# Altium schematic sheet Control Unit and Power.SchDoc: CONTROL UNIT AND POWER MANAGEMENT
size A2; DrawnBy: Avishka Herath; DocumentNumber: 2; Revision: 1.6; SheetNumber: 2; SheetTotal: 2; Project: Coco V2.0 PCB
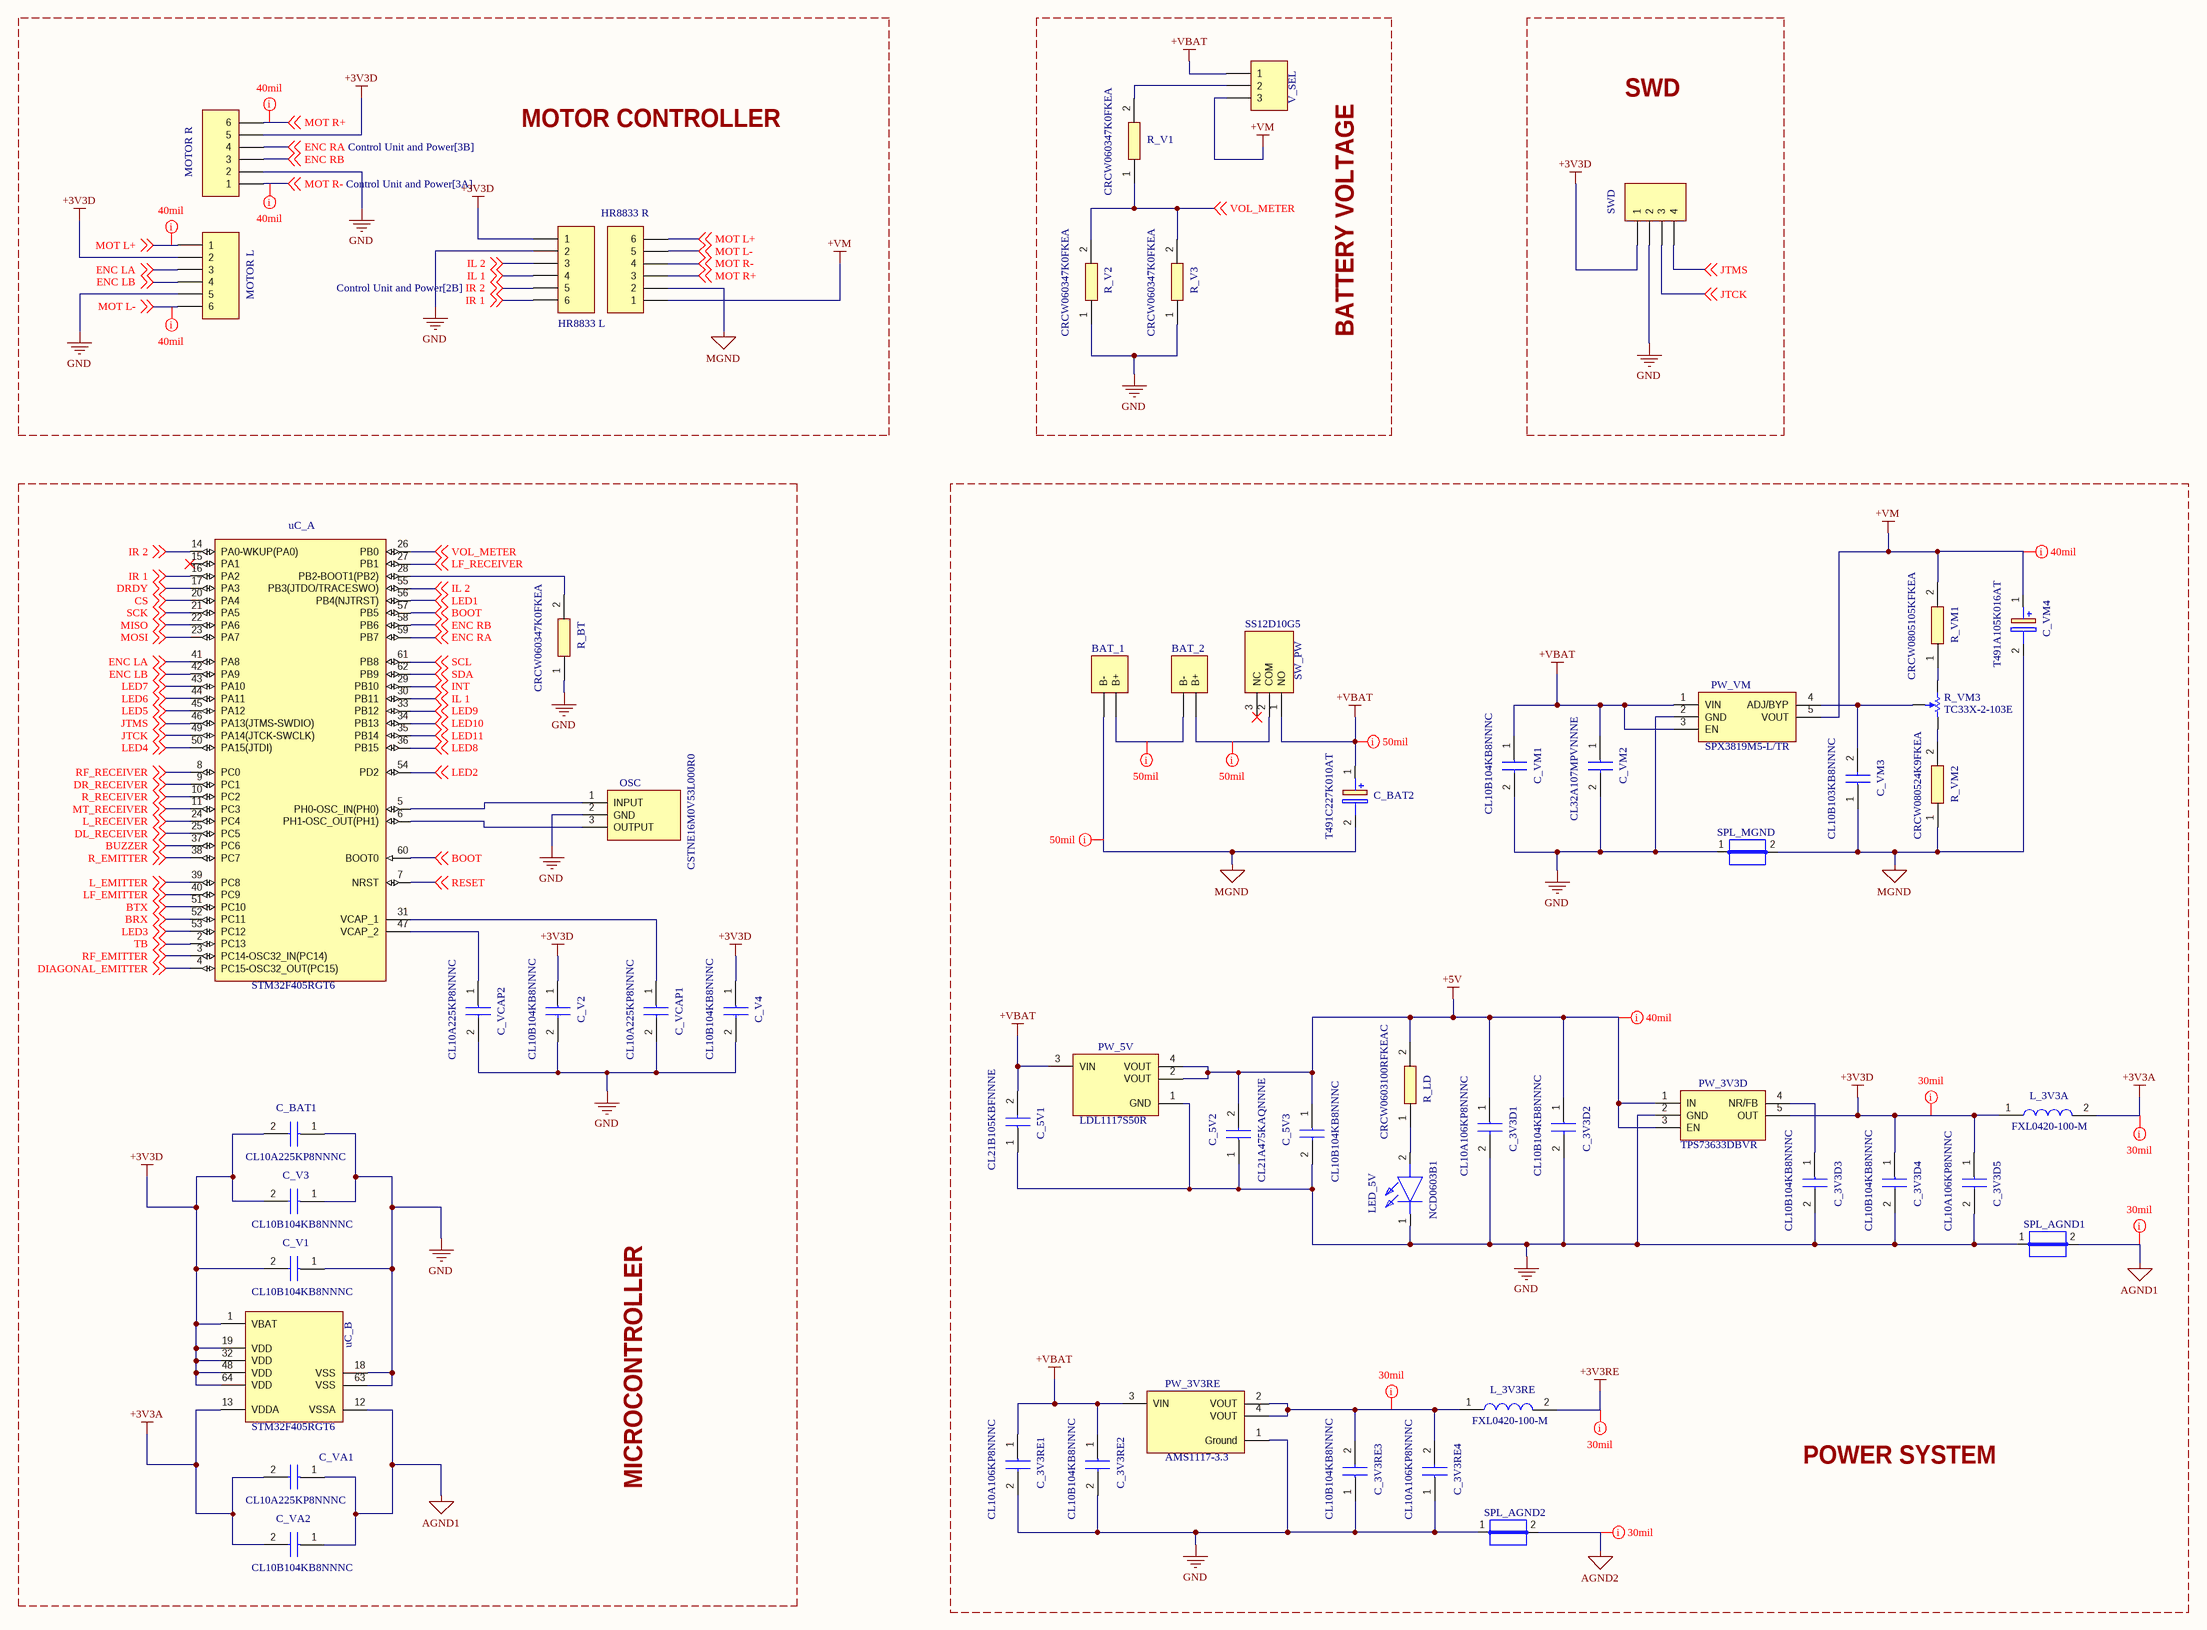
[diagram p0: Control Unit and Power.SchDoc]

## Parts
BAT_1  Header 2  [MY_6410-02]  (value not drawn)
BAT_2  Header 2  [MY_6410-02]  (value not drawn)
C_3V3D1  CL10A106KP8NNNC  [CAPC1608X90N]
C_3V3D2  CL10B104KB8NNNC  [CAPC1608X90N]
C_3V3D3  CL10B104KB8NNNC  [CAPC1608X90N]
C_3V3D4  CL10B104KB8NNNC  [CAPC1608X90N]
C_3V3D5  CL10A106KP8NNNC  [CAPC1608X90N]
C_3V3RE1  CL10A106KP8NNNC  [CAPC1608X90N]
C_3V3RE2  CL10B104KB8NNNC  [CAPC1608X90N]
C_3V3RE3  CL10B104KB8NNNC  [CAPC1608X90N]
C_3V3RE4  CL10A106KP8NNNC  [CAPC1608X90N]
C_5V1  CL21B105KBFNNNE  [CAPC2012X135N]
C_5V2  CL21A475KAQNNNE  [CAPC2012X140N]
C_5V3  CL10B104KB8NNNC  [CAPC1608X90N]
C_BAT1  CL10A225KP8NNNC  [CAPC1608X90N]
C_BAT2  T491C227K010AT  [T491C]
C_V1  CL10B104KB8NNNC  [CAPC1608X90N]
C_V2  CL10B104KB8NNNC  [CAPC1608X90N]
C_V3  CL10B104KB8NNNC  [CAPC1608X90N]
C_V4  CL10B104KB8NNNC  [CAPC1608X90N]
C_VA1  CL10A225KP8NNNC  [CAPC1608X90N]
C_VA2  CL10B104KB8NNNC  [CAPC1608X90N]
C_VCAP1  CL10A225KP8NNNC  [CAPC1608X90N]
C_VCAP2  CL10A225KP8NNNC  [CAPC1608X90N]
C_VM1  CL10B104KB8NNNC  [CAPC1608X90N]
C_VM2  CL32A107MPVNNNE  [CAPC3225X280N]
C_VM3  CL10B103KB8NNNC  [CAPC1608X90N]
C_VM4  T491A105K016AT  [T491A]
HR8833_L  Header 6  [My_1X06]  (value not drawn)
HR8833_R  Header 6  [My_1X06]  (value not drawn)
L_3V3A  FXL0420-100-M  [INDPM4441X120N]
L_3V3RE  FXL0420-100-M  [INDPM4441X120N]
LED_5V  NCD0603B1  [LEDC1608X40N]
MOTOR_L  Header 6  [MY_53253-0670]  (value not drawn)
MOTOR_R  Header 6  [MY_53253-0670]  (value not drawn)
OSC  CSTNE16M0V53L000R0  [CSTNE16M0V53L000R0]
PW_3V3D  TPS73633DBVR  [SOT95P280X145-5N]
PW_3V3RE  AMS1117-3.3  [FP-AMS1117-IPC_C]
PW_5V  LDL1117S50R  [FP-SOT-223-0046067_14-MFG]
PW_VM  SPX3819M5-L/TR  [SOT95P280X145-5N]
R_BT  CRCW060347K0FKEA  [RESC1608X50N]
R_LD  CRCW0603100RFKEAC  [RESC1608X55N]
R_V1  CRCW060347K0FKEA  [RESC1608X50N]
R_V2  CRCW060347K0FKEA  [RESC1608X50N]
R_V3  CRCW060347K0FKEA  [RESC1608X50N]
R_VM1  CRCW0805105KFKEA  [RESC2012X50N]
R_VM2  CRCW080524K9FKEA  [RESC2012X50N]
R_VM3  TC33X-2-103E  [BOUR-TC33X-2_V]
SPL_AGND1  JUMPER  [JUMPER]  (value not drawn)
SPL_AGND2  JUMPER  [JUMPER]  (value not drawn)
SPL_MGND  JUMPER  [JUMPER]  (value not drawn)
SW_PW  SS12D10G5  [GH36P010001]
SWD  Header 4  [MY_FE04]  (value not drawn)
uC_  STM32F405RGT6  [STM-LQFP64_V]  (parts A,B of 2)
V_SEL  Header 3  [My_1X03]  (value not drawn)

## Blocks framed on the sheet
MOTOR CONTROLLER: HR8833_L HR8833_R MOTOR_L MOTOR_R
BATTERY VOLTAGE: R_V1-R_V3 V_SEL
SWD: SWD
MICROCONTROLLER: C_BAT1 C_V1-C_V4 C_VA1 C_VA2 C_VCAP1 C_VCAP2 OSC R_BT uC_
POWER SYSTEM: BAT_1 BAT_2 C_3V3D1-C_3V3D5 C_3V3RE1-C_3V3RE4 C_5V1-C_5V3 C_BAT2 C_VM1-C_VM4 L_3V3A L_3V3RE LED_5V PW_3V3D PW_3V3RE PW_5V PW_VM R_LD R_VM1-R_VM3 SPL_AGND1 SPL_AGND2 SPL_MGND SW_PW

## Nets
+3V3A: C_VA1.2 C_VA2.2 L_3V3A.2 uC_.13(VDDA)
+3V3D: C_3V3D4.1 C_3V3D5.1 C_BAT1.2 C_V1.2 C_V2.1 C_V3.2 C_V4.1 HR8833_L.1 L_3V3A.1 MOTOR_L.2 MOTOR_R.5 PW_3V3D.5(OUT) SWD.1 uC_.1(VBAT) uC_.19(VDD) uC_.32(VDD) uC_.48(VDD) uC_.64(VDD)
+3V3RE: L_3V3RE.2
+5V: C_3V3D1.1 C_3V3D2.1 C_5V2.2 C_5V3.1 PW_3V3D.1(IN) PW_3V3D.3(EN) PW_5V.2(VOUT) PW_5V.4(VOUT) R_LD.2
+VBAT: C_3V3RE1.1 C_3V3RE2.1 C_5V1.2 C_BAT2.1(+) C_VM1.1 C_VM2.1 PW_3V3RE.3(VIN) PW_5V.3(VIN) PW_VM.1(VIN) PW_VM.3(EN) SW_PW.1(NO) V_SEL.1
+VM: C_VM4.1(+) HR8833_R.1 PW_VM.5(VOUT) R_VM1.2 V_SEL.3
AGND1: C_VA1.1 C_VA2.1 SPL_AGND1.2 uC_.12(VSSA)
AGND2: SPL_AGND2.2
GND: C_3V3D1.2 C_3V3D2.2 C_3V3D3.2 C_3V3D4.2 C_3V3D5.2 C_3V3RE1.2 C_3V3RE2.2 C_3V3RE3.1 C_3V3RE4.1 C_5V1.1 C_5V2.1 C_5V3.2 C_BAT1.1 C_V1.1 C_V2.2 C_V3.1 C_V4.2 C_VCAP1.2 C_VCAP2.2 C_VM1.2 C_VM2.2 HR8833_L.2 LED_5V.1(K) MOTOR_L.5 MOTOR_R.2 OSC.2(GND) PW_3V3D.2(GND) PW_3V3RE.1(Ground) PW_5V.1(GND) PW_VM.2(GND) R_BT.1 R_V2.1 R_V3.1 SPL_AGND1.1 SPL_AGND2.1 SPL_MGND.1 SWD.2 uC_.18(VSS) uC_.63(VSS)
MGND: BAT_1.2(B-) C_BAT2.2(-) C_VM3.1 C_VM4.2(-) HR8833_R.2 R_VM2.1 SPL_MGND.2
BOOT: uC_.57(PB5) uC_.60(BOOT0) ; off-sheet BOOT
BRX: uC_.52(PC11) ; off-sheet BRX
BTX: uC_.51(PC10) ; off-sheet BTX
BUZZER: uC_.37(PC6) ; off-sheet BUZZER
CS: uC_.20(PA4) ; off-sheet CS
DIAGONAL_EMITTER: uC_.4(PC15-OSC32_OUT(PC15)) ; off-sheet DIAGONAL_EMITTER
DL_RECEIVER: uC_.25(PC5) ; off-sheet DL_RECEIVER
DR_RECEIVER: uC_.9(PC1) ; off-sheet DR_RECEIVER
DRDY: uC_.17(PA3) ; off-sheet DRDY
ENC LA: MOTOR_L.3 uC_.41(PA8) ; off-sheet ENC LA
ENC LB: MOTOR_L.4 uC_.42(PA9) ; off-sheet ENC LB
ENC RA: MOTOR_R.4 uC_.59(PB7) ; off-sheet ENC RA
ENC RB: MOTOR_R.3 uC_.58(PB6) ; off-sheet ENC RB
IL 1: HR8833_L.4 uC_.30(PB11) ; off-sheet IL 1
IL 2: HR8833_L.3 uC_.55(PB3(JTDO/TRACESWO)) ; off-sheet IL 2
INT: uC_.29(PB10) ; off-sheet INT
IR 1: HR8833_L.6 uC_.16(PA2) ; off-sheet IR 1
IR 2: HR8833_L.5 uC_.14(PA0-WKUP(PA0)) ; off-sheet IR 2
JTCK: SWD.3 uC_.49(PA14(JTCK-SWCLK)) ; off-sheet JTCK
JTMS: SWD.4 uC_.46(PA13(JTMS-SWDIO)) ; off-sheet JTMS
L_EMITTER: uC_.39(PC8) ; off-sheet L_EMITTER
L_RECEIVER: uC_.24(PC4) ; off-sheet L_RECEIVER
LED1: uC_.56(PB4(NJTRST)) ; off-sheet LED1
LED2: uC_.54(PD2) ; off-sheet LED2
LED3: uC_.53(PC12) ; off-sheet LED3
LED4: uC_.50(PA15(JTDI)) ; off-sheet LED4
LED5: uC_.45(PA12) ; off-sheet LED5
LED6: uC_.44(PA11) ; off-sheet LED6
LED7: uC_.43(PA10) ; off-sheet LED7
LED8: uC_.36(PB15) ; off-sheet LED8
LED9: uC_.33(PB12) ; off-sheet LED9
LED10: uC_.34(PB13) ; off-sheet LED10
LED11: uC_.35(PB14) ; off-sheet LED11
LF_EMITTER: uC_.40(PC9) ; off-sheet LF_EMITTER
LF_RECEIVER: uC_.27(PB1) ; off-sheet LF_RECEIVER
MISO: uC_.22(PA6) ; off-sheet MISO
MOSI: uC_.23(PA7) ; off-sheet MOSI
MOT L+: HR8833_R.6 MOTOR_L.1 ; off-sheet MOT L+
MOT L-: HR8833_R.5 MOTOR_L.6 ; off-sheet MOT L-
MOT R+: HR8833_R.3 MOTOR_R.6 ; off-sheet MOT R+
MOT R-: HR8833_R.4 MOTOR_R.1 ; off-sheet MOT R-
MT_RECEIVER: uC_.11(PC3) ; off-sheet MT_RECEIVER
R_EMITTER: uC_.38(PC7) ; off-sheet R_EMITTER
R_RECEIVER: uC_.10(PC2) ; off-sheet R_RECEIVER
RESET: uC_.7(NRST) ; off-sheet RESET
RF_EMITTER: uC_.3(PC14-OSC32_IN(PC14)) ; off-sheet RF_EMITTER
RF_RECEIVER: uC_.8(PC0) ; off-sheet RF_RECEIVER
SCK: uC_.21(PA5) ; off-sheet SCK
SCL: uC_.61(PB8) ; off-sheet SCL
SDA: uC_.62(PB9) ; off-sheet SDA
TB: uC_.2(PC13) ; off-sheet TB
VOL_METER: R_V1.1 R_V2.2 R_V3.2 uC_.26(PB0) ; off-sheet VOL_METER
NetBAT_1_1: BAT_1.1(B+) BAT_2.2(B-)
NetBAT_2_1: BAT_2.1(B+) SW_PW.2(COM)
NetC_3V3D3_1: C_3V3D3.1 PW_3V3D.4(NR/FB)
NetC_3V3RE3_2: C_3V3RE3.2 C_3V3RE4.2 L_3V3RE.1 PW_3V3RE.2(VOUT) PW_3V3RE.4(VOUT)
NetC_VCAP1_1: C_VCAP1.1 uC_.31(VCAP_1)
NetC_VCAP2_1: C_VCAP2.1 uC_.47(VCAP_2)
NetC_VM3_2: C_VM3.2 PW_VM.4(ADJ/BYP) R_VM3.2
NetLED_5V_2: LED_5V.2(A) R_LD.1
NetOSC_1: OSC.1(INPUT) uC_.5(PH0-OSC_IN(PH0))
NetOSC_3: OSC.3(OUTPUT) uC_.6(PH1-OSC_OUT(PH1))
NetR_BT_2: R_BT.2 uC_.28(PB2-BOOT1(PB2))
NetR_V1_2: R_V1.2 V_SEL.2
NetR_VM1_1: R_VM1.1 R_VM3.1
NetR_VM2_2: R_VM2.2 R_VM3.3

Not connected (* = marked no-connect by the designer): SW_PW 3(NC)*; uC_ 15(PA1)*

## Layout directives
rule Width Constraint [Pref Width = 50mil    Min Width = 50mil    Max Width = 50mil]; rule Supply Nets [Voltage = 7.400]: +VBAT, MGND, NetBAT_1_1, NetBAT_2_1
rule Width Constraint [Pref Width = 40mil    Min Width = 40mil    Max Width = 40mil]; rule Supply Nets [Voltage = 6.000]: +VM
rule Width Constraint [Pref Width = 40mil    Min Width = 40mil    Max Width = 40mil]; rule Supply Nets [Voltage = 5.000]: +5V
rule Width Constraint [Pref Width = 30mil    Min Width = 30mil    Max Width = 30mil]; rule Supply Nets [Voltage = 3.300]: +3V3A, +3V3D, +3V3RE, NetC_3V3RE3_2
rule Width Constraint [Pref Width = 30mil    Min Width = 30mil    Max Width = 30mil]: AGND1, AGND2
rule Width Constraint [Pref Width = 40mil    Min Width = 40mil    Max Width = 40mil]: MOT L+, MOT L-, MOT R+, MOT R-

## Notes on the sheet
- Title:
- Size:
- Date:
- Project:
- A2
- Document Number:
- Drawn By:
- Sheet
- Revision:
- of

## Library data of the parts
BAT_1 BAT_2 = Header 2: Header, 2-Pin; ASiD Part Number: Header 2-AS
C_3V3D1 C_3V3D5 C_3V3RE1 C_3V3RE4 = CL10A106KP8NNNC: Capacitor; Manufacturer_Name: SAMSUNG; Datasheet Link: https://datasheet.datasheetarchive.com/originals/distributors/Datasheets-DGA10/2415998.pdf; Height: 0.9mm; Manufacturer_Part_Number: CL10A106KP8NNNC; Mouser Part Number: 187-CL10A106KP8NNNC; Mouser Price/Stock: https://www.mouser.co.uk/ProductDetail/Samsung-Electro-Mechanics/CL10A106KP8NNNC?qs=X6jEic%2FHinAlyfRHj7fKwg%3D%3D; Arrow Part Number: CL10A106KP8NNNC; Arrow Price/Stock: https://www.arrow.com/en/products/cl10a106kp8nnnc/samsung-electro-mechanics?region=europe
C_3V3D2-C_3V3D4 C_3V3RE2 C_3V3RE3 C_5V3 C_V1-C_V4 C_VA2 C_VM1 = CL10B104KB8NNNC: Capacitor; Manufacturer_Name: SAMSUNG; Datasheet Link: https://datasheet.datasheetarchive.com/originals/distributors/Datasheets-DGA10/2408969.pdf; Height: 0.9mm; Manufacturer_Part_Number: CL10B104KB8NNNC; Mouser Part Number: 187-CL10B104KB8NNNC; Mouser Price/Stock: https://www.mouser.co.uk/ProductDetail/Samsung-Electro-Mechanics/CL10B104KB8NNNC?qs=349EhDEZ59rvGc2rLwVOdA%3D%3D; Arrow Part Number: CL10B104KB8NNNC; Arrow Price/Stock: https://www.arrow.com/en/products/cl10b104kb8nnnc/samsung-electro-mechanics?region=nac
C_5V1 = CL21B105KBFNNNE: Capacitor; Manufacturer_Name: SAMSUNG; Datasheet Link: https://componentsearchengine.com/Datasheets/2/CL21B105KBFNNNE.pdf; Height: 1.35mm; Manufacturer_Part_Number: CL21B105KBFNNNE; Mouser Part Number: 187-CL21B105KBFNNNE; Mouser Price/Stock: https://www.mouser.co.uk/ProductDetail/Samsung-Electro-Mechanics/CL21B105KBFNNNE?qs=yOVawPpwOwmddQEBPU6Y9A%3D%3D; Arrow Part Number: CL21B105KBFNNNE; Arrow Price/Stock: https://www.arrow.com/en/products/cl21b105kbfnnne/samsung-electro-mechanics?region=europe
C_5V2 = CL21A475KAQNNNE: Capacitor; Manufacturer_Name: SAMSUNG; Datasheet Link: https://datasheet.datasheetarchive.com/originals/distributors/Datasheets_SAMA/7c2e9fae61a8ce6685f6522ddec12c79.pdf; Height: 1.4mm; Manufacturer_Part_Number: CL21A475KAQNNNE; Mouser Part Number: 187-CL21A475KAQNNNE; Mouser Price/Stock: https://www.mouser.co.uk/ProductDetail/Samsung-Electro-Mechanics/CL21A475KAQNNNE?qs=yOVawPpwOwkWIBpK%2Fbg0Aw%3D%3D; Arrow Part Number: CL21A475KAQNNNE; Arrow Price/Stock: https://www.arrow.com/en/products/cl21a475kaqnnne/samsung-electro-mechanics?region=europe
C_BAT1 C_VA1 C_VCAP1 C_VCAP2 = CL10A225KP8NNNC: Capacitor; Manufacturer_Name: SAMSUNG; Datasheet Link: https://datasheet.datasheetarchive.com/originals/distributors/Datasheets-DGA10/2411103.pdf; Height: 0.9mm; Manufacturer_Part_Number: CL10A225KP8NNNC; Mouser Part Number: 187-CL10A225KP8NNNC; Mouser Price/Stock: https://www.mouser.co.uk/ProductDetail/Samsung-Electro-Mechanics/CL10A225KP8NNNC?qs=hqM3L16%252Bxldb5UYUGQVB5Q%3D%3D; Arrow Part Number: CL10A225KP8NNNC; Arrow Price/Stock: https://www.arrow.com/en/products/cl10a225kp8nnnc/samsung-electro-mechanics?region=europe
C_BAT2 = T491C227K010AT: Capacitor Polarised; Manufacturer_Name: KEMET; Datasheet Link: https://content.kemet.com/datasheets/KEM_T2005_T491.pdf; Height: 2.8mm; Manufacturer_Part_Number: T491C227K010AT; Mouser Part Number: 80-T491C227K010AT; Mouser Price/Stock: https://www.mouser.co.uk/ProductDetail/KEMET/T491C227K010AT?qs=wo4x%252BUeoG8X8nx3rGRELKA%3D%3D; Arrow Part Number: T491C227K010AT; Arrow Price/Stock: https://www.arrow.com/en/products/t491c227k010at/kemet-corporation
C_VM2 = CL32A107MPVNNNE: Capacitor; Manufacturer_Name: SAMSUNG; Datasheet Link: http://uk.rs-online.com/web/p/products/7661179; Height: 2.8mm; Manufacturer_Part_Number: CL32A107MPVNNNE; Mouser Part Number: 187-CL32A107MPVNNNE; Mouser Price/Stock: https://www.mouser.co.uk/ProductDetail/Samsung-Electro-Mechanics/CL32A107MPVNNNE?qs=X6jEic%2FHinBwGsPYz57S5w%3D%3D; Arrow Part Number: CL32A107MPVNNNE; Arrow Price/Stock: https://www.arrow.com/en/products/cl32a107mpvnnne/samsung-electro-mechanics?region=nac
C_VM3 = CL10B103KB8NNNC: Capacitor; Manufacturer_Name: SAMSUNG; Datasheet Link: https://datasheet.datasheetarchive.com/originals/distributors/Datasheets_SAMA/f3f01ceab90a863c6d6e9eba92d45bd3.pdf; Height: 0.9mm; Manufacturer_Part_Number: CL10B103KB8NNNC; Mouser Part Number: 187-CL10B103KB8NNNC; Mouser Price/Stock: https://www.mouser.co.uk/ProductDetail/Samsung-Electro-Mechanics/CL10B103KB8NNNC?qs=349EhDEZ59pAsZxZjVI0UQ%3D%3D; Arrow Part Number: CL10B103KB8NNNC; Arrow Price/Stock: https://www.arrow.com/en/products/cl10b103kb8nnnc/samsung-electro-mechanics?region=nac
C_VM4 = T491A105K016AT: Capacitor Polarised; Manufacturer_Name: KEMET; Datasheet Link: https://content.kemet.com/datasheets/KEM_T2005_T491.pdf; Height: 1.8mm; Manufacturer_Part_Number: T491A105K016AT; Mouser Part Number: 80-T491A105K016; Mouser Price/Stock: https://www.mouser.co.uk/ProductDetail/KEMET/T491A105K016AT?qs=rZB7yXOqaoskTND3m0TpXQ%3D%3D; Arrow Part Number: T491A105K016AT; Arrow Price/Stock: https://www.arrow.com/en/products/t491a105k016at/kemet-corporation?region=nac
HR8833_L HR8833_R MOTOR_L MOTOR_R = Header 6: Header, 6-Pin; ASiD Part Number: Header 6-AS
L_3V3A L_3V3RE = PM4546.331NLT: 1.6A 10uH Integrated molded inductor ±20% 2.2A SMD,4.2x4.4mm Power Inductors ROHS; Manufacturer_Name: Pulse Electronics; Datasheet Link: https://eu.mouser.com/datasheet/2/447/P823-2902976.pdf; Height: 1.2mm; Manufacturer_Part_Number: PM4546.331NLT; Mouser Part Number: 673-PM4546.331NLT; Mouser Price/Stock: https://www.mouser.co.uk/ProductDetail/Pulse-Electronics/PM4546.331NLT?qs=l7cgNqFNU1hugV30hoiS7g%3D%3D
LED_5V = LB_Q39E-L2OO-35-1: 20mA Colorless transparent lens 80mcd~220mcd 463nm~475nm -30℃~+85℃ Blue 130° 72mW 2.6V~3.6V 0603 LED Indication - Discrete ROHS; Manufacturer_Name: ams OSRAM; Manufacturer_Part_Number: LB Q39E-L2OO-35-1; Datasheet Link: https://componentsearchengine.com/Datasheets/1/LBQ39E-L2OO-35-1.pdf; Height: 0.4mm; Mouser Part Number: 720-LBQ39EL2N2351; Mouser Price/Stock: https://www.mouser.co.uk/ProductDetail/OSRAM-Opto-Semiconductors/LB-Q39E-L2OO-35-1?qs=74fRo9GAWsz%2FeNvglIOl1w%3D%3D; Arrow Part Number: LB Q39E-L2OO-35-1; Arrow Price/Stock: https://www.arrow.com/en/products/lbq39e-l2oo-35-1/osram-opto-semiconductors
OSC = CSTNE16M0V53L000R0: Crystal or Oscillator; Manufacturer_Name: Murata Electronics; Datasheet Link: https://www.murata.com/products/productdata/8805969166366/SPEC-CSTNE16M0V53L000R0.pdf; Height: 1mm; Manufacturer_Part_Number: CSTNE16M0V53L000R0; Mouser Part Number: 81-CSTNE16M0V53L000R; Mouser Price/Stock: https://www.mouser.co.uk/ProductDetail/Murata-Electronics/CSTNE16M0V53L000R0?qs=vmHwEFxEFR%2FxinNCjb%2FE3g%3D%3D; Arrow Part Number: CSTNE16M0V53L000R0; Arrow Price/Stock: null?region=nac
PW_3V3D = TPS73633DBVR: Integrated Circuit; Manufacturer_Name: Texas Instruments; Datasheet Link: http://www.ti.com/lit/gpn/tps736; Height: 1.45mm; Manufacturer_Part_Number: TPS73633DBVR; Mouser Part Number: 595-TPS73633DBVR; Mouser Price/Stock: https://www.mouser.co.uk/ProductDetail/Texas-Instruments/TPS73633DBVR?qs=6zVL%252ByCp0mrGq%2FL4KaY0Yw%3D%3D; Arrow Part Number: TPS73633DBVR; Arrow Price/Stock: https://www.arrow.com/en/products/tps73633dbvr/texas-instruments?region=nac
PW_3V3RE = CMP-209535-000001-1: LDO Voltage Regulators 1A, 3.3V; Manufacturer: Advanced Monolithic Systems; Dropout Voltage: 1.1V; Output Type: Fixed; Nominal Supply Current: 5mA; Max Power Dissipation: 1.2W; Max Supply Voltage: 15V; Number Of Outputs: 1; Standoff Height: 0.64mm; Max Junction Temp: +125°C; Height: 1.8mm; Package: AMS1117; Device Class L2: Power Management ICs; ComponentLink2Description: Datasheet; ComponentLink2URL: http://www.advanced-monolithic.com/pdf/ds1117.pdf; Category: IC; RoHS: TRUE; Automotive: No; Device Class L1: Integrated Circuits (ICs); Output Current: 1A; Device Class L3: Voltage Regulators - Linear; Temperature: -40°C to +125°C; Output Voltage: 3.3V; Manufacturer Part Number: AMS1117-3.3; Temperature Range Low: -40°C; Octopart: https://octopart.com/ams1117-3.3-advanced+monolithic+systems-25899300; Lead Free: Yes; Ipc Land Pattern Name: SOT229P700X180-4; Temperature Range High: +125°C
PW_5V = CMP-12153-000005-1: IC REG LINEAR 5V 1.2A SOT223; Manufacturer: STMicroelectronics; Standoff Height: 0.02mm; Min Supply Voltage: 2.6V; Nominal Supply Current: 250uA; Max Junction Temp: +150°C; Accuracy Percentage: 2%; Output Type: Fixed; Max Supply Voltage: 18V; Output Current: 2A; Number Of Outputs: 1; Dropout Voltage: 350mV; ComponentLink2Description: Datasheet; Temperature Range High: +125°C; Manufacturer Part Number: LDL1117S50R; Digikey Description: IC REG LINEAR 5V 1.2A SOT223; Device Class L2: Power Management ICs; RoHS: TRUE; Temperature: -40°C to +125°C; Device Class L3: Voltage Regulators - Linear; Automotive: No; Mouser Description: LDL1117 Series 1.2 A 5 V High PSRR LDO Linear Voltage Regulator - SOT-223; Package: SOT-223-0046067_14; ComponentLink2URL: https://www.st.com/content/ccc/resource/technical/document/datasheet/group3/0e/5a/00/ca/10/1a/4f/a5/DM00366442/files/DM00366442.pdf/jcr:content/translations/en.DM00366442.pdf; Output Voltage: 5V; Octopart: https://octopart.com/ldl1117s50r-stmicroelectronics-81876164; Category: IC; Device Class L1: Integrated Circuits (ICs); Temperature Range Low: -40°C; Height: 1.9mm; Lead Free: Yes
PW_VM = SPX3819M5-L_TR: Integrated Circuit; Manufacturer_Name: EXAR; Datasheet Link: https://componentsearchengine.com/Datasheets/1/SPX3819M5-L_TR.pdf; Height: 1.45mm; Manufacturer_Part_Number: SPX3819M5-L/TR; Mouser Part Number: 701-SPX3819M5-L/TR; Mouser Price/Stock: https://www.mouser.com/Search/Refine.aspx?Keyword=701-SPX3819M5-L%2FTR
R_BT R_V1-R_V3 = CRCW060347K0FKEA: Resistor; Manufacturer_Name: Vishay; Datasheet Link: http://www.vishay.com/docs/20035/dcrcwe3.pdf; Height: 0.5mm; Manufacturer_Part_Number: CRCW060347K0FKEA; Mouser Part Number: 71-CRCW0603-47K-E3; Mouser Price/Stock: https://www.mouser.co.uk/ProductDetail/Vishay-Dale/CRCW060347K0FKEA?qs=yJVtgANCw03gcaACf6JZKA%3D%3D; Arrow Part Number: CRCW060347K0FKEA; Arrow Price/Stock: https://www.arrow.com/en/products/crcw060347k0fkea/vishay?region=nac
R_LD = CRCW0603100RFKEAC: Resistor; Manufacturer_Name: Vishay; Datasheet Link: https://componentsearchengine.com/Datasheets/1/CRCW0603100RFKEAC.pdf; Height: 0.55mm; Manufacturer_Part_Number: CRCW0603100RFKEAC; Mouser Part Number: 71-CRCW0603100RFKEAC; Mouser Price/Stock: https://www.mouser.co.uk/ProductDetail/Vishay-Dale/CRCW0603100RFKEAC?qs=E3Y5ESvWgWPJqb4%2F19sAKw%3D%3D; Arrow Part Number: CRCW0603100RFKEAC; Arrow Price/Stock: https://www.arrow.com/en/products/crcw0603100rfkeac/vishay?utm_currency=USD&region=nac
R_VM1 = CRCW0805105KFKEA: Resistor; Manufacturer_Name: Vishay; Datasheet Link: http://www.vishay.com/docs/20035/dcrcwe3.pdf; Height: 0.5mm; Manufacturer_Part_Number: CRCW0805105KFKEA; Mouser Part Number: 71-CRCW0805-105K-E3; Mouser Price/Stock: https://www.mouser.com/Search/Refine.aspx?Keyword=71-CRCW0805-105K-E3; Arrow Part Number: CRCW0805105KFKEA; Arrow Price/Stock: https://www.arrow.com/en/products/crcw0805105kfkea/vishay
R_VM2 = CRCW080524K9FKEA: Resistor; Manufacturer_Name: Vishay; Datasheet Link: http://www.vishay.com/docs/20035/dcrcwe3.pdf; Height: 0.5mm; Manufacturer_Part_Number: CRCW080524K9FKEA; Mouser Part Number: 71-CRCW0805-24.9K-E3; Mouser Price/Stock: https://www.mouser.co.uk/ProductDetail/Vishay-Dale/CRCW080524K9FKEA?qs=hdPY9BlFm%252BfjvoBJhmYH%252Bw%3D%3D; Arrow Part Number: CRCW080524K9FKEA; Arrow Price/Stock: https://www.arrow.com/en/products/crcw080524k9fkea/vishay
R_VM3 = CMP-2100-03695-1: Trimming Potentiometer, 10000 Ohm, -40 to 100 degC, 3-Pin SMD, RoHS, Tape and Reel; Manufacturer: Bourns; Tolerance: 25%; Max Power Dissipation: 100mW; Number of Turns: 1; Resistance: 10KOhm; Temperature Coefficient: 250ppm/degreesC; Voltage Rating (DC): 50V; Datasheet URL: http://www.bourns.com/docs/Product-Datasheets/TC33.pdf; Composition: Potentiometer; Package Description: 3-Pin Surface Mount Device, Body 3.8 x 3.6 mm; Weight: 29.4mg; Power Rating: 100mW; Termination: FootPrint; Manufacturer URL: http://www.bourns.com/; Width: 0.118inch; Height: 0.047inch; Military Standard: Not; Radiation Hardening: No; Colour: Silver; Case/Package: SMD/SMT; Depth: 3.8mm; Min Operating Temperature: -40degC; Lead Free: LeadFree; Datasheet Version: 42583.0; REACH SVHC: NoSVHC; Length: 3mm; RoHSCompliant: true; Contact Plating: Silver; Taper: Linear; Packaging: TapeandReel; Mount: SurfaceMount; Max Operating Temperature: 100degC; Package Reference: TC33X-2; Package Quantity: 2500
SPL_AGND1 SPL_AGND2 SPL_MGND = CMP-009-00061-2: Pins: 2
SW_PW = GH36P010001: Bend insert 2A Single Pole Double Throw (SPDT) 125V 3000 times Black Plugin Slide Switches ROHS; Manufacturer_Name: Apem; Datasheet Link: https://www.apem.com/media/apemProduct/PCB_slideswitches_serie_G.pdf; Height: 13.35mm; Manufacturer_Part_Number: GH36P010001; Mouser Part Number: 642-GH36P010001; Mouser Price/Stock: https://www.mouser.co.uk/ProductDetail/Apem/GH36P010001?qs=VdTcGPmBZ7BA0hpkTJ33kw%3D%3D
SWD = Header 4: Header, 4-Pin; ASiD Part Number: Header 4-AS
uC_ = CMP-0243-00019-3: ARM Cortex-M4 32-bit MCU+FPU, 210 DMIPS, 1024 kB Flash, 192 kB Internal RAM, 51 I/Os, 64-pin LQFP, -40 to 85 degC, Tray; Manufacturer: STMicroelectronics; Supply Voltage(Vcc) min (V): 1.8; Supply Voltage(Vcc) max (V): 3.6; Internal RAM Size (kB): 192; I/Os (High Current): 51; D/A Converter: 2x12-bit; FLASH Size (Prog) (kB): 1024; Operating Frequency(F) (Processor speed) (MHz): 168; ComponentLink2Description: Datasheet; PackageVersion: Rev. 4, 06/2013; DatasheetVersion: Rev. 4; Core: ARM Cortex-M4; ComponentLink2URL: http://www.st.com/st-web-ui/static/active/en/resource/technical/document/datasheet/DM00037051.pdf; PackageReference: LQFP64; Packing: Tray; ComponentLink1Description: Manufacturer URL; ComponentLink3URL: http://www.st.com/st-web-ui/static/active/en/resource/technical/document/datasheet/DM00037051.pdf; ComponentLink3Description: Package Specification; Mounting Technology: Surface Mount; ComponentLink1URL: http://www.st.com/web/en/home.html; PackageDescription: 64-Pin Low Profile Quad Flat Package, 10 x 10 mm Body, 0.5 mm Pitch; PartNumber: STM32F405RGT6
V_SEL = Header 3: Header, 3-Pin; ASiD Part Number: Header 3-AS